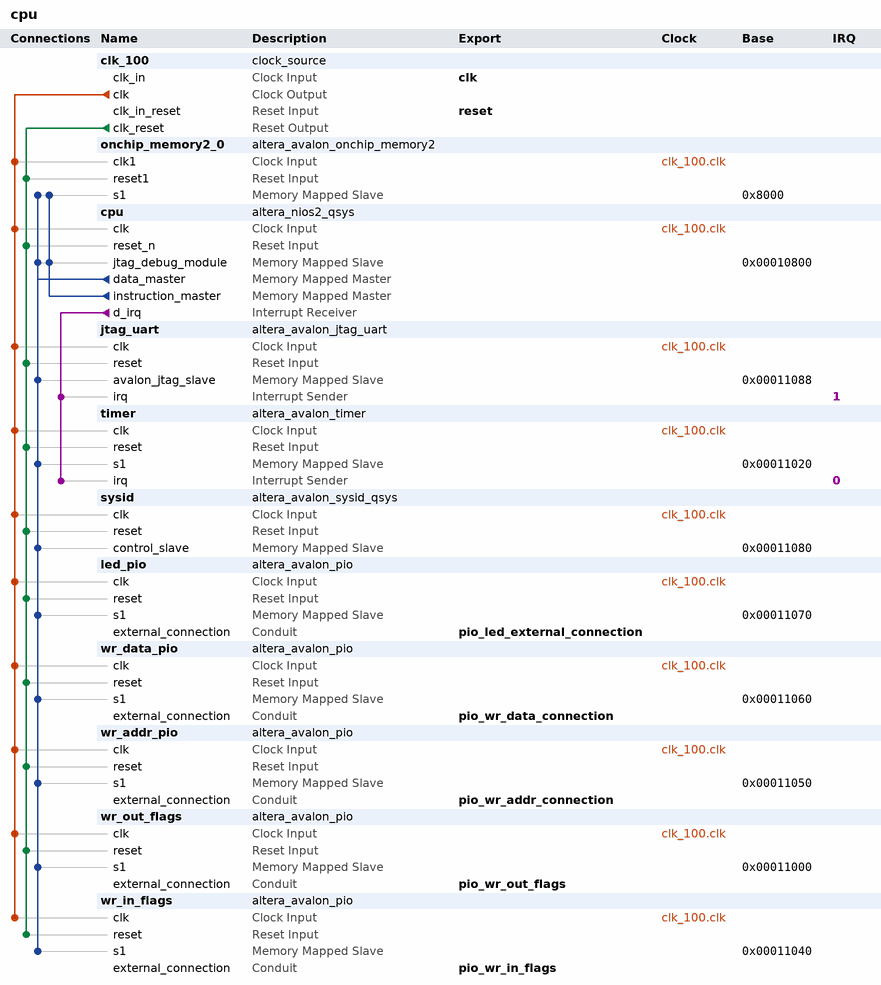
[diagram p0: system contents]
# Platform Designer (Qsys) system cpu, Cyclone IV E EP4CE22F17C6
# Parameters at their usual value, and those the tool derives, are not listed.
package require -exact qsys 16.0
create_system cpu
set_project_property DEVICE_FAMILY {Cyclone IV E}
set_project_property DEVICE EP4CE22F17C6

add_instance clk_100 clock_source 16.0
set_instance_parameter_value clk_100 clockFrequency 100000000

add_instance onchip_memory2_0 altera_avalon_onchip_memory2 16.0
set_instance_parameter_value onchip_memory2_0 dataWidth 32
set_instance_parameter_value onchip_memory2_0 dualPort false
set_instance_parameter_value onchip_memory2_0 initMemContent true
set_instance_parameter_value onchip_memory2_0 initializationFileName onchip_mem.hex
set_instance_parameter_value onchip_memory2_0 memorySize 20480

add_instance cpu altera_nios2_qsys 16.0
set_instance_parameter_value cpu breakSlave cpu.jtag_debug_module
set_instance_parameter_value cpu exceptionSlave onchip_memory2_0.s1
set_instance_parameter_value cpu icache_size 4096
set_instance_parameter_value cpu impl Small
set_instance_parameter_value cpu mmu_TLBMissExcSlave None
set_instance_parameter_value cpu resetSlave onchip_memory2_0.s1
set_instance_parameter_value cpu resetrequest_enabled true

add_instance jtag_uart altera_avalon_jtag_uart 16.0
set_instance_parameter_value jtag_uart simInteractiveOptions NO_INTERACTIVE_WINDOWS

add_instance timer altera_avalon_timer 16.0
set_instance_parameter_value timer period 10
set_instance_parameter_value timer periodUnits USEC

add_instance sysid altera_avalon_sysid_qsys 16.0
set_instance_parameter_value sysid id 0

add_instance led_pio altera_avalon_pio 16.0
set_instance_parameter_value led_pio direction Output
set_instance_parameter_value led_pio width 8

add_instance wr_data_pio altera_avalon_pio 16.0
set_instance_parameter_value wr_data_pio direction Output
set_instance_parameter_value wr_data_pio width 24

add_instance wr_addr_pio altera_avalon_pio 16.0
set_instance_parameter_value wr_addr_pio direction Output
set_instance_parameter_value wr_addr_pio width 12

add_instance wr_out_flags altera_avalon_pio 16.0
set_instance_parameter_value wr_out_flags bitModifyingOutReg true
set_instance_parameter_value wr_out_flags direction Output
set_instance_parameter_value wr_out_flags width 8

add_instance wr_in_flags altera_avalon_pio 16.0
set_instance_parameter_value wr_in_flags direction Input
set_instance_parameter_value wr_in_flags width 8

# connections
add_connection clk_100.clk cpu.clk clock
add_connection clk_100.clk jtag_uart.clk clock
add_connection clk_100.clk led_pio.clk clock
add_connection clk_100.clk onchip_memory2_0.clk1 clock
add_connection clk_100.clk sysid.clk clock
add_connection clk_100.clk timer.clk clock
add_connection clk_100.clk wr_addr_pio.clk clock
add_connection clk_100.clk wr_data_pio.clk clock
add_connection clk_100.clk wr_in_flags.clk clock
add_connection clk_100.clk wr_out_flags.clk clock
add_connection clk_100.clk_reset cpu.reset_n reset
add_connection clk_100.clk_reset jtag_uart.reset reset
add_connection clk_100.clk_reset led_pio.reset reset
add_connection clk_100.clk_reset onchip_memory2_0.reset1 reset
add_connection clk_100.clk_reset sysid.reset reset
add_connection clk_100.clk_reset timer.reset reset
add_connection clk_100.clk_reset wr_addr_pio.reset reset
add_connection clk_100.clk_reset wr_data_pio.reset reset
add_connection clk_100.clk_reset wr_in_flags.reset reset
add_connection clk_100.clk_reset wr_out_flags.reset reset
add_connection cpu.data_master cpu.jtag_debug_module avalon
set_connection_parameter_value cpu.data_master/cpu.jtag_debug_module baseAddress 0x00010800
add_connection cpu.data_master jtag_uart.avalon_jtag_slave avalon
set_connection_parameter_value cpu.data_master/jtag_uart.avalon_jtag_slave baseAddress 0x00011088
add_connection cpu.data_master led_pio.s1 avalon
set_connection_parameter_value cpu.data_master/led_pio.s1 baseAddress 0x00011070
add_connection cpu.data_master onchip_memory2_0.s1 avalon
set_connection_parameter_value cpu.data_master/onchip_memory2_0.s1 baseAddress 0x8000
add_connection cpu.data_master sysid.control_slave avalon
set_connection_parameter_value cpu.data_master/sysid.control_slave baseAddress 0x00011080
add_connection cpu.data_master timer.s1 avalon
set_connection_parameter_value cpu.data_master/timer.s1 baseAddress 0x00011020
add_connection cpu.data_master wr_addr_pio.s1 avalon
set_connection_parameter_value cpu.data_master/wr_addr_pio.s1 baseAddress 0x00011050
add_connection cpu.data_master wr_data_pio.s1 avalon
set_connection_parameter_value cpu.data_master/wr_data_pio.s1 baseAddress 0x00011060
add_connection cpu.data_master wr_in_flags.s1 avalon
set_connection_parameter_value cpu.data_master/wr_in_flags.s1 baseAddress 0x00011040
add_connection cpu.data_master wr_out_flags.s1 avalon
set_connection_parameter_value cpu.data_master/wr_out_flags.s1 baseAddress 0x00011000
add_connection cpu.instruction_master cpu.jtag_debug_module avalon
set_connection_parameter_value cpu.instruction_master/cpu.jtag_debug_module baseAddress 0x00010800
add_connection cpu.instruction_master onchip_memory2_0.s1 avalon
set_connection_parameter_value cpu.instruction_master/onchip_memory2_0.s1 baseAddress 0x8000
add_connection cpu.d_irq jtag_uart.irq interrupt
set_connection_parameter_value cpu.d_irq/jtag_uart.irq irqNumber 1
add_connection cpu.d_irq timer.irq interrupt
set_connection_parameter_value cpu.d_irq/timer.irq irqNumber 0

# exported interfaces
add_interface clk clock sink
set_interface_property clk EXPORT_OF clk_100.clk_in
add_interface pio_led_external_connection conduit end
set_interface_property pio_led_external_connection EXPORT_OF led_pio.external_connection
add_interface pio_wr_addr_connection conduit end
set_interface_property pio_wr_addr_connection EXPORT_OF wr_addr_pio.external_connection
add_interface pio_wr_data_connection conduit end
set_interface_property pio_wr_data_connection EXPORT_OF wr_data_pio.external_connection
add_interface pio_wr_in_flags conduit end
set_interface_property pio_wr_in_flags EXPORT_OF wr_in_flags.external_connection
add_interface pio_wr_out_flags conduit end
set_interface_property pio_wr_out_flags EXPORT_OF wr_out_flags.external_connection
add_interface reset reset sink
set_interface_property reset EXPORT_OF clk_100.clk_in_reset

set_interconnect_requirement {$system} qsys_mm.clockCrossingAdapter HANDSHAKE
set_interconnect_requirement {$system} qsys_mm.enableEccProtection FALSE
set_interconnect_requirement {$system} qsys_mm.insertDefaultSlave FALSE
set_interconnect_requirement {$system} qsys_mm.maxAdditionalLatency 1

save_system cpu.qsys
